# Altium schematic sheet MODULE_1.SchDoc
size B
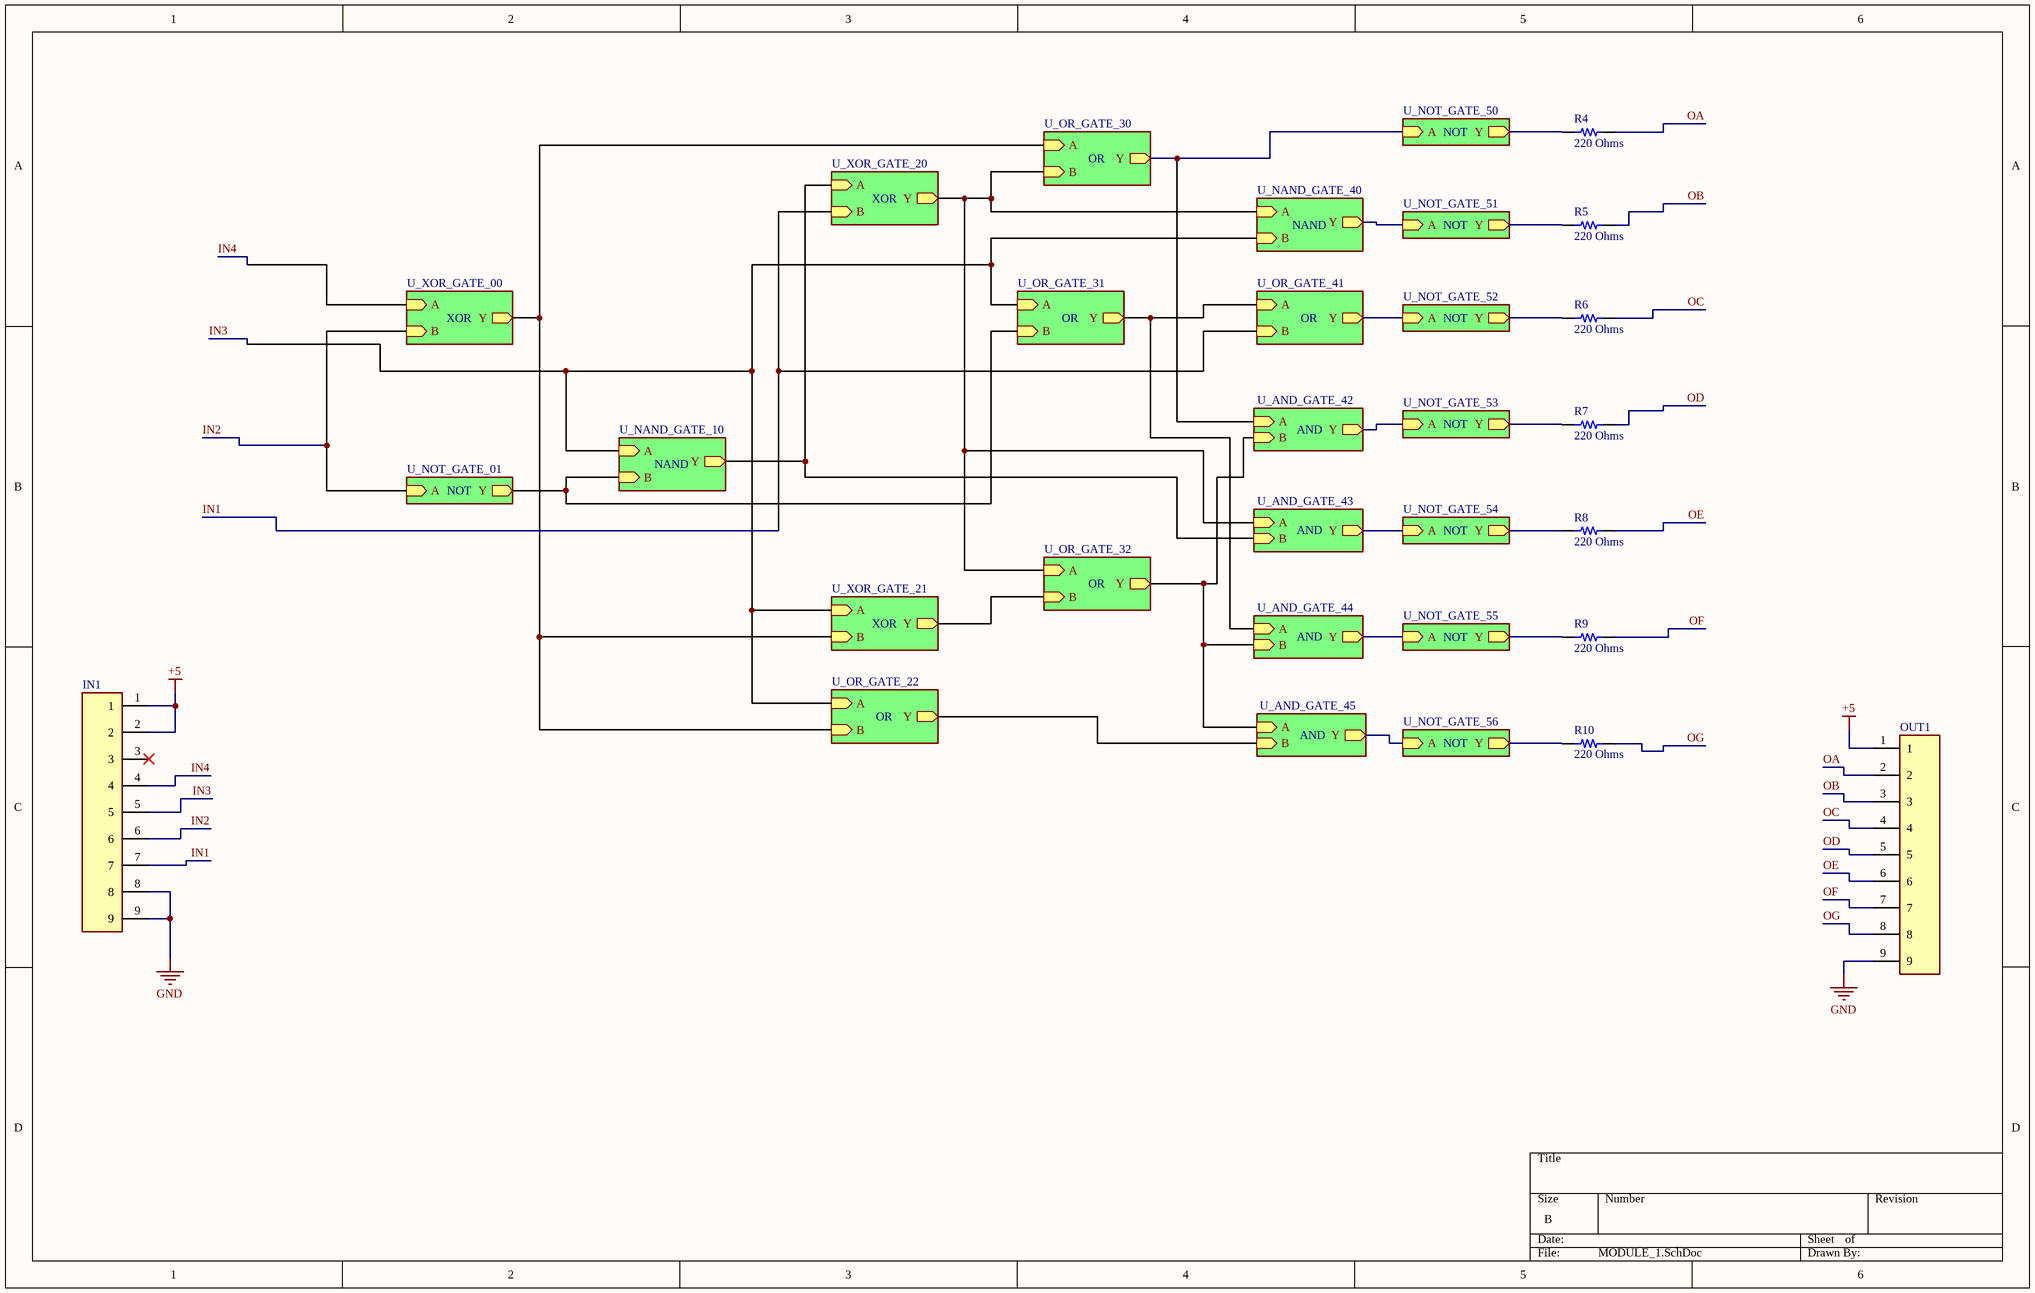
[diagram p0: MODULE_1.SchDoc]

## Parts
IN1  2.54mm_TH_1x9_pin_header  [2.54mm_TH_1x9_pin_header]  (value not drawn)
OUT1  2.54mm_TH_1x9_pin_header  [2.54mm_TH_1x9_pin_header]  (value not drawn)
R4  220 Ohms  [RES 0603_1608]
R5  220 Ohms  [RES 0603_1608]
R6  220 Ohms  [RES 0603_1608]
R7  220 Ohms  [RES 0603_1608]
R8  220 Ohms  [RES 0603_1608]
R9  220 Ohms  [RES 0603_1608]
R10  220 Ohms  [RES 0603_1608]

## Sub-sheets
U_AND_GATE_42 = AND_GATE.SchDoc: Y (out), A (in), B (in)
U_AND_GATE_43 = AND_GATE.SchDoc: Y (out), A (in), B (in)
U_AND_GATE_44 = AND_GATE.SchDoc: Y (out), A (in), B (in)
U_AND_GATE_45 = AND_GATE.SchDoc: Y (out), A (in), B (in)
U_NAND_GATE_10 = NAND_GATE.SchDoc: Y (out), A (in), B (in)
U_NAND_GATE_40 = NAND_GATE.SchDoc: Y (out), A (in), B (in)
U_NOT_GATE_01 = NOT_GATE.SchDoc: Y (out), A (in)
U_NOT_GATE_50 = NOT_GATE.SchDoc: Y (out), A (in)
U_NOT_GATE_51 = NOT_GATE.SchDoc: Y (out), A (in)
U_NOT_GATE_52 = NOT_GATE.SchDoc: Y (out), A (in)
U_NOT_GATE_53 = NOT_GATE.SchDoc: Y (out), A (in)
U_NOT_GATE_54 = NOT_GATE.SchDoc: Y (out), A (in)
U_NOT_GATE_55 = NOT_GATE.SchDoc: Y (out), A (in)
U_NOT_GATE_56 = NOT_GATE.SchDoc: Y (out), A (in)
U_OR_GATE_22 = OR_GATE.SchDoc: Y (out), A (in), B (in)
U_OR_GATE_30 = OR_GATE.SchDoc: Y (out), A (in), B (in)
U_OR_GATE_31 = OR_GATE.SchDoc: Y (out), A (in), B (in)
U_OR_GATE_32 = OR_GATE.SchDoc: Y (out), A (in), B (in)
U_OR_GATE_41 = OR_GATE.SchDoc: Y (out), A (in), B (in)
U_XOR_GATE_00 = XOR_GATE.SchDoc: Y (out), A (in), B (in)
U_XOR_GATE_20 = XOR_GATE.SchDoc: Y (out), A (in), B (in)
U_XOR_GATE_21 = XOR_GATE.SchDoc: Y (out), A (in), B (in)

## Nets
+5: IN1.1 IN1.2 OUT1.1
GND: IN1.8 IN1.9 OUT1.9
IN1: IN1.7 ; sheet U_XOR_GATE_20/B, sheet U_OR_GATE_41/B
IN2: IN1.6 ; sheet U_XOR_GATE_00/B, sheet U_NOT_GATE_01/A
IN3: IN1.5 ; sheet U_OR_GATE_22/A, sheet U_NAND_GATE_10/A, sheet U_XOR_GATE_21/A, sheet U_OR_GATE_31/A, sheet U_NAND_GATE_40/B
IN4: IN1.4 ; sheet U_XOR_GATE_00/A
OA: OUT1.2 R4.2
OB: OUT1.3 R5.2
OC: OUT1.4 R6.2
OD: OUT1.5 R7.2
OE: OUT1.6 R8.2
OF: OUT1.7 R9.2
OG: OUT1.8 R10.2
NetR4_1: R4.1 ; sheet U_NOT_GATE_50/Y
NetR5_1: R5.1 ; sheet U_NOT_GATE_51/Y
NetR6_1: R6.1 ; sheet U_NOT_GATE_52/Y
NetR7_1: R7.1 ; sheet U_NOT_GATE_53/Y
NetR8_1: R8.1 ; sheet U_NOT_GATE_54/Y
NetR9_1: R9.1 ; sheet U_NOT_GATE_55/Y
NetR10_1: R10.1 ; sheet U_NOT_GATE_56/Y
(unnamed): sheet U_XOR_GATE_00/Y, sheet U_OR_GATE_22/B, sheet U_XOR_GATE_21/B, sheet U_OR_GATE_30/A
(unnamed): sheet U_NOT_GATE_01/Y, sheet U_NAND_GATE_10/B, sheet U_OR_GATE_31/B
(unnamed): sheet U_OR_GATE_22/Y, sheet U_AND_GATE_45/B
(unnamed): sheet U_AND_GATE_42/Y, sheet U_NOT_GATE_53/A
(unnamed): sheet U_AND_GATE_42/A, sheet U_OR_GATE_30/Y, sheet U_NOT_GATE_50/A
(unnamed): sheet U_AND_GATE_42/B, sheet U_OR_GATE_32/Y, sheet U_AND_GATE_44/B, sheet U_AND_GATE_45/A
(unnamed): sheet U_NAND_GATE_10/Y, sheet U_XOR_GATE_20/A, sheet U_AND_GATE_43/B
(unnamed): sheet U_XOR_GATE_20/Y, sheet U_OR_GATE_30/B, sheet U_OR_GATE_32/A, sheet U_NAND_GATE_40/A, sheet U_AND_GATE_43/A
(unnamed): sheet U_XOR_GATE_21/Y, sheet U_OR_GATE_32/B
(unnamed): sheet U_OR_GATE_31/Y, sheet U_OR_GATE_41/A, sheet U_AND_GATE_44/A
(unnamed): sheet U_NAND_GATE_40/Y, sheet U_NOT_GATE_51/A
(unnamed): sheet U_OR_GATE_41/Y, sheet U_NOT_GATE_52/A
(unnamed): sheet U_AND_GATE_43/Y, sheet U_NOT_GATE_54/A
(unnamed): sheet U_AND_GATE_44/Y, sheet U_NOT_GATE_55/A
(unnamed): sheet U_AND_GATE_45/Y, sheet U_NOT_GATE_56/A

Not connected (* = marked no-connect by the designer): IN1 3*

## Notes on the sheet
- OR
- NOT
- XOR
- NAND
- AND

## Library data of the parts
R4-R10 = ERA-3AED221V: RES SMD 220 OHM 0.5% 1/10W 0603; Manufacturer: Panasonic Electronic Components; Power (Watts): 0.1W, 1/10W; Temperature Coefficient: ±25ppm/°C; Part Number: ERA-3AED221V; Value: 220 Ohms; ComponentLink1Description: Datasheet; ComponentLink1URL: https://industrial.panasonic.com/cdbs/www-data/pdf/RDM0000/AOA0000C307.pdf; ComponentLink2Description: DigiKey Link; ComponentLink2URL: https://www.digikey.com/en/products/detail/panasonic-electronic-components/ERA-3AED221V/9373509; Composition: Thin Film; Device Package: 0603 (1608 Metric); Features: Automotive AEC-Q200; Height - Seated (Max): 0.022" (0.55mm); LastUpdated: 2/9/2024 8:43:36 PM; Lifecycle Status: Active; Minimum Order: 1; Number of Terminations: 2; Operating Temperature: -55°C ~ 155°C; Package / Case: 0603 (1608 Metric); Packaging: TapeAndReel; PartId: 4952; Part Status: Active; Price: 0.03; Ratings: AEC-Q200; Resistance: 220 Ohms; Series: ERA-3A; Size / Dimension: 0.063" L x 0.031" W (1.60mm x 0.80mm); Supplier 1: DigiKey; Supplier Part Number 1: P123752CT-ND; Supplier Device Package: 0603; Tolerance: ±0.5%